# Altium schematic sheet MCU.SchDoc
size A4
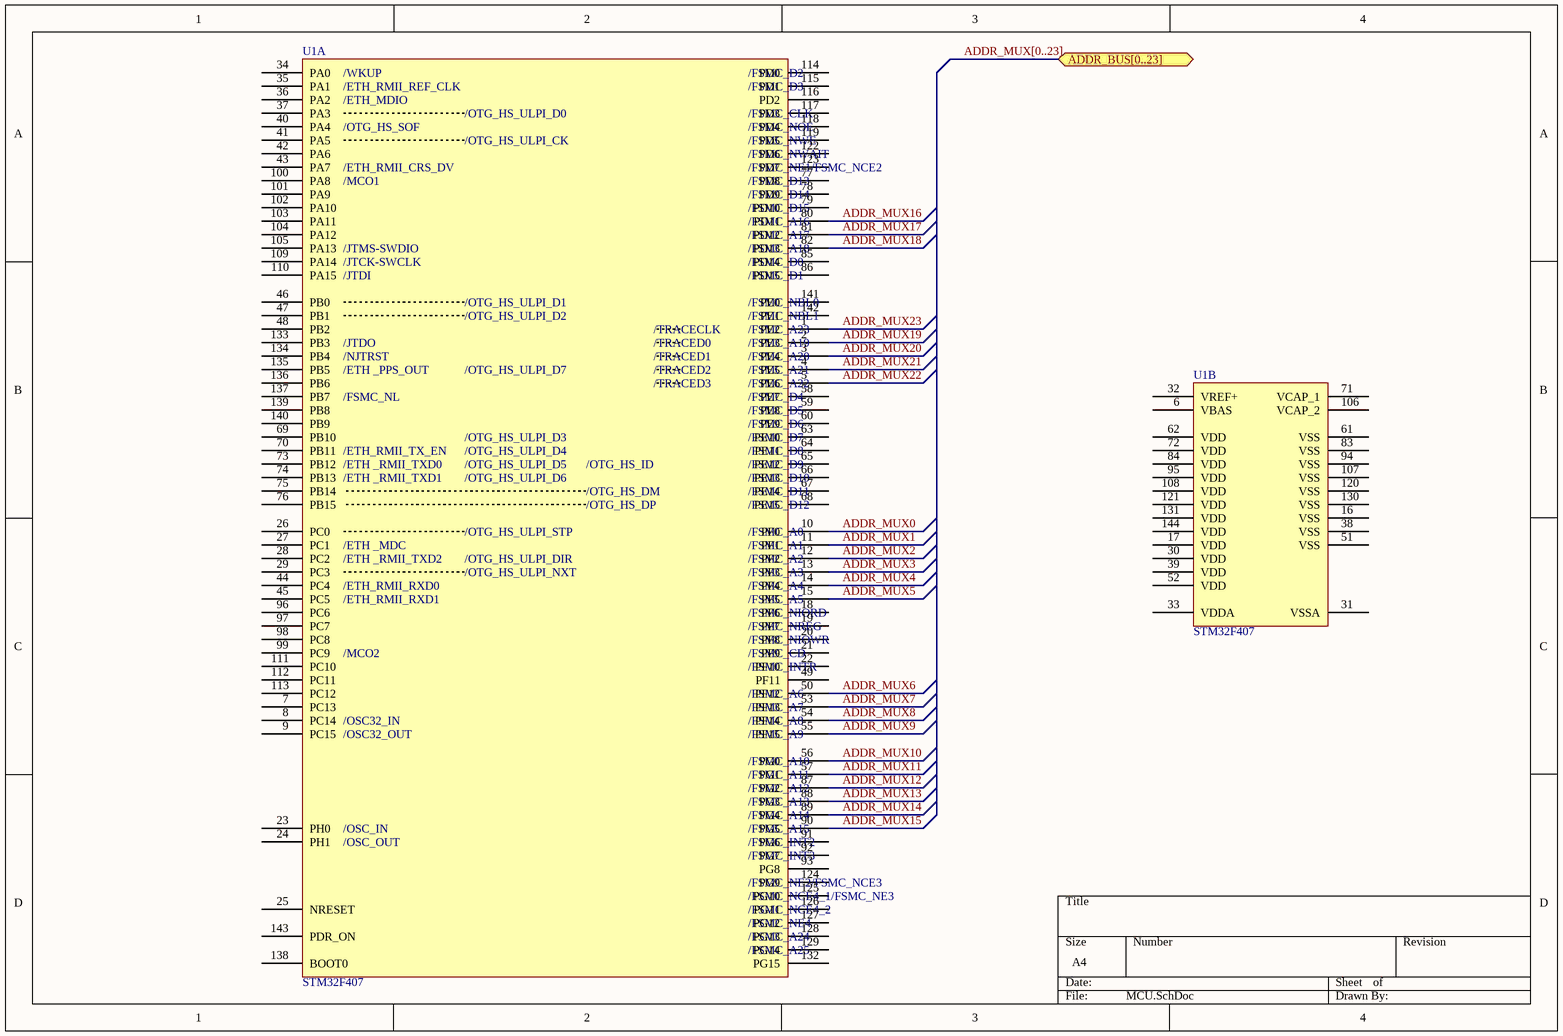
[diagram p0: MCU.SchDoc]

## Parts
U1  STM32F407  [LQFP144]  (parts A,B of 2)

## Ports
ADDR_BUS[0..23]

## Nets
ADDR_MUX0: U1.10(PF0)
ADDR_MUX1: U1.11(PF1)
ADDR_MUX2: U1.12(PF2)
ADDR_MUX3: U1.13(PF3)
ADDR_MUX4: U1.14(PF4)
ADDR_MUX5: U1.15(PF5)
ADDR_MUX6: U1.50(PF12)
ADDR_MUX7: U1.53(PF13)
ADDR_MUX8: U1.54(PF14)
ADDR_MUX9: U1.55(PF15)
ADDR_MUX10: U1.56(PG0)
ADDR_MUX11: U1.57(PG1)
ADDR_MUX12: U1.87(PG2)
ADDR_MUX13: U1.88(PG3)
ADDR_MUX14: U1.89(PG4)
ADDR_MUX15: U1.90(PG5)
ADDR_MUX16: U1.80(PD11)
ADDR_MUX17: U1.81(PD12)
ADDR_MUX18: U1.82(PD13)
ADDR_MUX19: U1.2(PE3)
ADDR_MUX20: U1.3(PE4)
ADDR_MUX21: U1.4(PE5)
ADDR_MUX22: U1.5(PE6)
ADDR_MUX23: U1.1(PE2)

Not connected (* = marked no-connect by the designer): U1 6(VBAS) 7(PC13) 8(PC14) 9(PC15) 16(VSS) 17(VDD) 18(PF6) 19(PF7) 20(PF8) 21(PF9) 22(PF10) 23(PH0) 24(PH1) 25(NRESET) 26(PC0) 27(PC1) 28(PC2) 29(PC3) 30(VDD) 31(VSSA) 32(VREF+) 33(VDDA) 34(PA0) 35(PA1) 36(PA2) 37(PA3) 38(VSS) 39(VDD) 40(PA4) 41(PA5) 42(PA6) 43(PA7) 44(PC4) 45(PC5) 46(PB0) 47(PB1) 48(PB2) 49(PF11) 51(VSS) 52(VDD) 58(PE7) 59(PE8) 60(PE9) 61(VSS) 62(VDD) 63(PE10) 64(PE11) 65(PE12) 66(PE13) 67(PE14) 68(PE15) 69(PB10) 70(PB11) 71(VCAP_1) 72(VDD) 73(PB12) 74(PB13) 75(PB14) 76(PB15) 77(PD8) 78(PD9) 79(PD10) 83(VSS) 84(VDD) 85(PD14) 86(PD15) 91(PG6) 92(PG7) 93(PG8) 94(VSS) 95(VDD) 96(PC6) 97(PC7) 98(PC8) 99(PC9) 100(PA8) 101(PA9) 102(PA10) 103(PA11) 104(PA12) 105(PA13) 106(VCAP_2) 107(VSS) 108(VDD) 109(PA14) 110(PA15) 111(PC10) 112(PC11) 113(PC12) 114(PD0) 115(PD1) 116(PD2) 117(PD3) 118(PD4) 119(PD5) 120(VSS) 121(VDD) 122(PD6) 123(PD7) 124(PG9) 125(PG10) 126(PG11) 127(PG12) 128(PG13) 129(PG14) 130(VSS) 131(VDD) 132(PG15) 133(PB3) 134(PB4) 135(PB5) 136(PB6) 137(PB7) 138(BOOT0) 139(PB8) 140(PB9) 141(PE0) 142(PE1) 143(PDR_ON) 144(VDD)

## Buses and harness runs
bus ADDR_MUX[0..23] = port ADDR_BUS[0..23]

## Notes on the sheet
- (in symbol STM32F407ZGT6, part A) /WKUP; /FSMC_D2; /ETH_RMII_REF_CLK; /FSMC_D3; /ETH_MDIO; /OTG_HS_ULPI_D0; /FSMC_CLK; /OTG_HS_SOF; /FSMC_NOE; /OTG_HS_ULPI_CK; /FSMC_NWE; /FSMC_NWAIT; /ETH_RMII_CRS_DV; /FSMC_NE1/FSMC_NCE2; /MCO1; /FSMC_D13; /FSMC_D14; /FSMC_D15; /FSMC_A16; /FSMC_A17; /JTMS-SWDIO; /FSMC_A18; /JTCK-SWCLK; /FSMC_D0; /JTDI; /FSMC_D1; /OTG_HS_ULPI_D1; /FSMC_NBL0; /OTG_HS_ULPI_D2; /FSMC_NBL1; /TRACECLK; /FSMC_A23; /JTDO; /TRACED0; /FSMC_A19; /NJTRST; /TRACED1; /FSMC_A20; /ETH _PPS_OUT; /OTG_HS_ULPI_D7; /TRACED2; /FSMC_A21; /TRACED3; /FSMC_A22; /FSMC_NL; /FSMC_D4; /FSMC_D5; /FSMC_D6; /OTG_HS_ULPI_D3; /FSMC_D7; /ETH_RMII_TX_EN; /OTG_HS_ULPI_D4; /FSMC_D8; /ETH _RMII_TXD0; /OTG_HS_ULPI_D5; /OTG_HS_ID; /FSMC_D9; /ETH _RMII_TXD1; /OTG_HS_ULPI_D6; /FSMC_D10; /OTG_HS_DM; /FSMC_D11; /OTG_HS_DP; /FSMC_D12; /OTG_HS_ULPI_STP; /FSMC_A0; /ETH _MDC; /FSMC_A1; /ETH _RMII_TXD2; /OTG_HS_ULPI_DIR; /FSMC_A2; /OTG_HS_ULPI_NXT; /FSMC_A3; /ETH_RMII_RXD0; /FSMC_A4; /ETH_RMII_RXD1; /FSMC_A5; /FSMC_NIORD; /FSMC_NREG; /FSMC_NIOWR; /MCO2; /FSMC_CD; /FSMC_INTR; /FSMC_A6; /FSMC_A7; /OSC32_IN; /FSMC_A8; /OSC32_OUT; /FSMC_A9; /FSMC_A10; /FSMC_A11; /FSMC_A12; /FSMC_A13; /FSMC_A14; /OSC_IN; /FSMC_A15; /OSC_OUT; /FSMC_INT2; /FSMC_INT3; /FSMC_NE2/FSMC_NCE3; /FSMC_NCE4_1/FSMC_NE3; /FSMC_NCE4_2; /FSMC_NE4; /FSMC_A24; /FSMC_A25

## Library data of the parts
U1 = STM32F407ZGT6: ST Microcontroller ARM 32-bit Cortex M4